# EAGLE design arduino_ver2 (EAGLE 9.6.2)
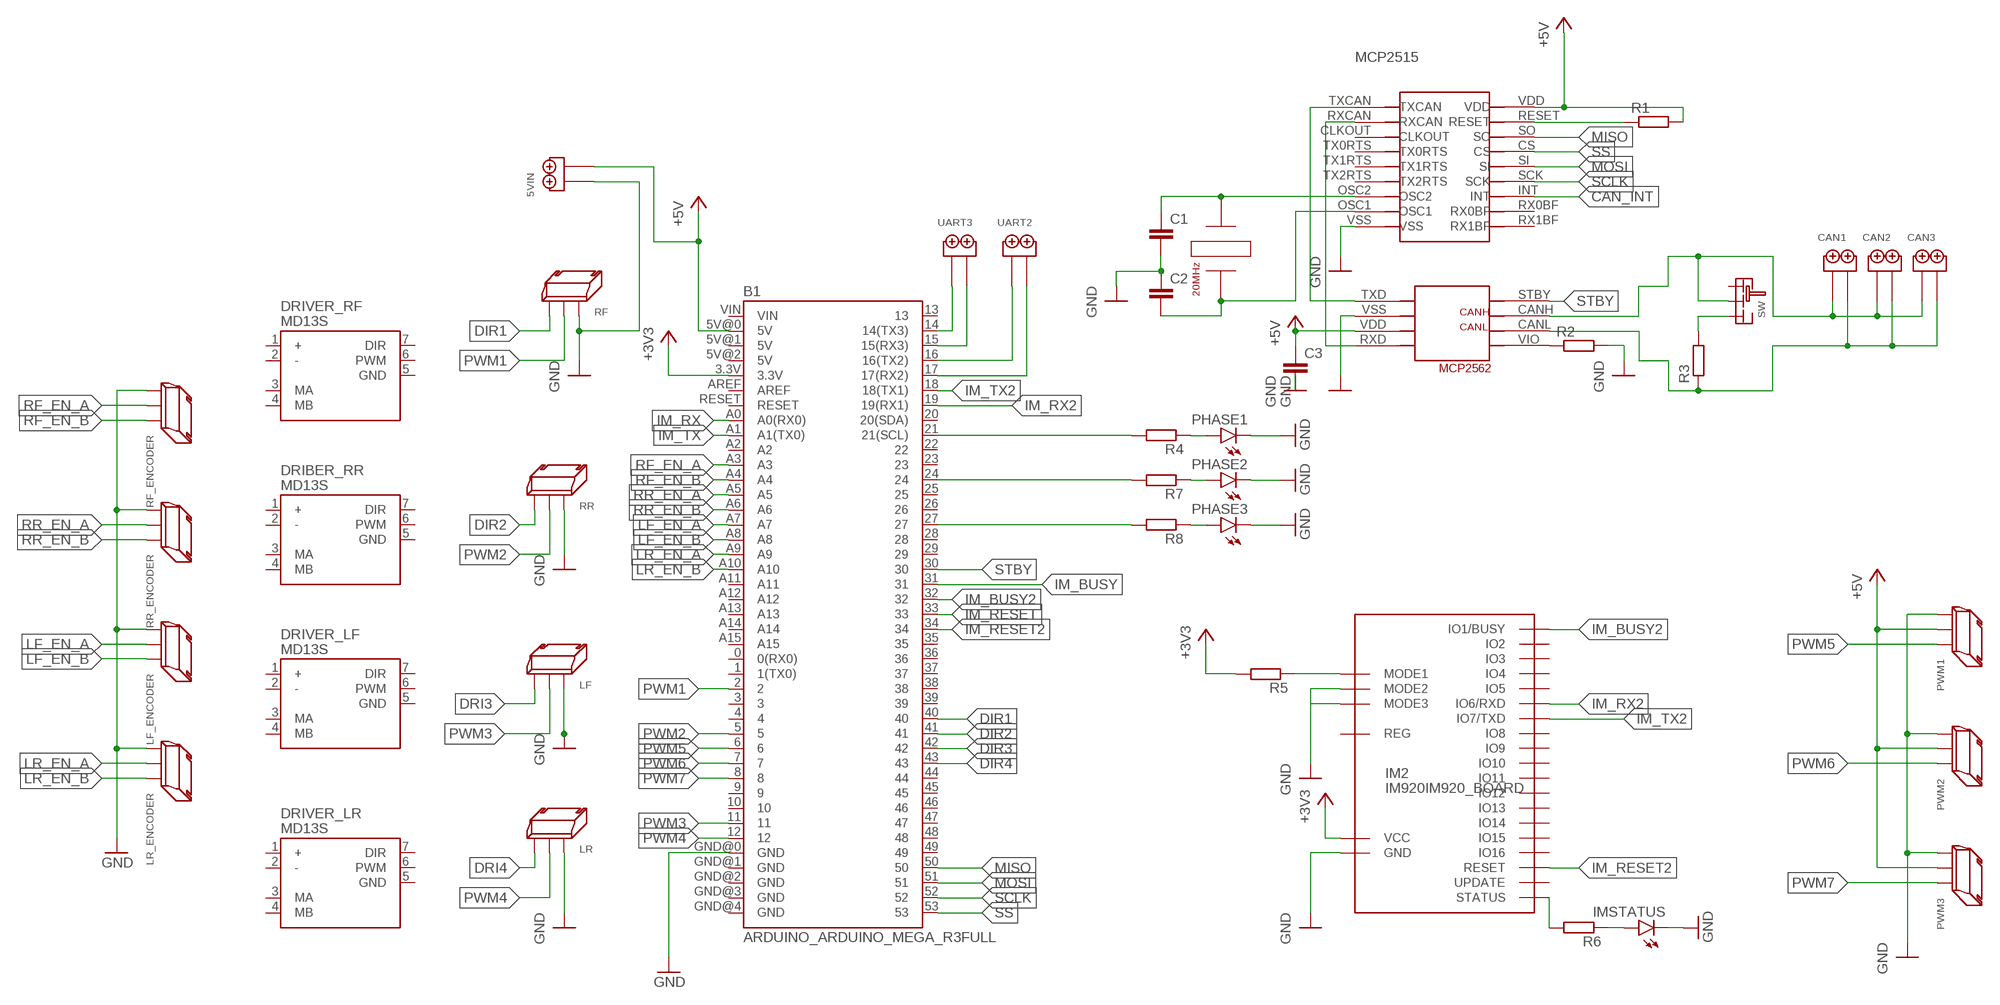
[diagram p0: schematic, sheet 1]

## Parts
5VIN  2PIN  [2PIN]
B1  ARDUINO_ARDUINO_MEGA_R3FULL  [ARDUINO_ARDUINO_MEGA]
C1  C-EU025-024X044  [C025-024X044]
C2  C-EU025-024X044  [C025-024X044]
C3  C-EU025-024X044  [C025-024X044]
CAN1  2PIN  [2PIN]
CAN2  2PIN  [2PIN]
CAN3  2PIN  [2PIN]
DRIBER_RR  MD13S  [MD13S]
DRIVER_LF  MD13S  [MD13S]
DRIVER_LR  MD13S  [MD13S]
DRIVER_RF  MD13S  [MD13S]
IM2  IM920IM920_BOARD  [IM920_BOARD]
IMSTATUS  LED3MM  [LED3MM]
LF  3PIN_SIDE  [3PIN_SIDE]
LF_ENCODER  3PIN_SIDE  [3PIN_SIDE]
LR  3PIN_SIDE  [3PIN_SIDE]
LR_ENCODER  3PIN_SIDE  [3PIN_SIDE]
MCP2  MCP2515  [MCP2515]
PHASE1  LED3MM  [LED3MM]
PHASE2  LED3MM  [LED3MM]
PHASE3  LED3MM  [LED3MM]
PWM1  3PIN_SIDE  [3PIN_SIDE]
PWM2  3PIN_SIDE  [3PIN_SIDE]
PWM3  3PIN_SIDE  [3PIN_SIDE]
R1  R-EU_0207/10  [0207/10]
R2  R-EU_0207/10  [0207/10]
R3  R-EU_0207/10  [0207/10]
R4  R-EU_0207/10  [0207/10]
R5  R-EU_0207/10  [0207/10]
R6  R-EU_0207/10  [0207/10]
R7  R-EU_0207/10  [0207/10]
R8  R-EU_0207/10  [0207/10]
RF  3PIN_SIDE  [3PIN_SIDE]
RF_ENCODER  3PIN_SIDE  [3PIN_SIDE]
RR  3PIN_SIDE  [3PIN_SIDE]
RR_ENCODER  3PIN_SIDE  [3PIN_SIDE]
SW  SRIDE_SWITCH  [SRIDE_SWITCH]
U$1  MCP2562  [MCP2562]
U$3  HUSG20  [HUSG20]
UART2  2PIN  [2PIN]
UART3  2PIN  [2PIN]

## Nets
+3V3: B1.3.3V R5.2
+5V [power]: 5VIN.P$2 B1.5V@0(5V) C3.1 MCP2.VDD R1.2 U$1.VDD
CAN_INT: MCP2.INT
DIR1: B1.40 RF.P$2
DIR2: B1.41 RR.P$2
DIR3: B1.42
DIR4: B1.43
DRI3: LF.P$2
DRI4: LR.P$2
GND: B1.GND@0(GND) IMSTATUS.K(C) LF_ENCODER.P$2 LR_ENCODER.P$2 PHASE1.K(C) PHASE2.K(C) PHASE3.K(C) R2.2 RF_ENCODER.P$2 RR_ENCODER.P$2
IM_BUSY: B1.31
IM_BUSY2 [im]: B1.32 IM2.IO1(IO1/BUSY)
IM_RESET: B1.33
IM_RESET2: B1.34 IM2.IO25(RESET)
IM_RX: B1.A0(A0(RX0))
IM_RX2 [im]: B1.19(19(RX1)) IM2.IO6(IO6/RXD)
IM_TX: B1.A1(A1(TX0))
IM_TX2 [im]: B1.18(18(TX1)) IM2.IO7(IO7/TXD)
LF_EN_A: B1.A7 LF_ENCODER.P$1
LF_EN_B: B1.A8 LF_ENCODER.P$3
LR_EN_A: B1.A9 LR_ENCODER.P$1
LR_EN_B: B1.A10 LR_ENCODER.P$3
MISO: B1.50 MCP2.SO
MOSI: B1.51 MCP2.SI
N$1: C1.1 MCP2.OSC2 U$3.A
N$2: C2.2 MCP2.OSC1 U$3.B
N$3: MCP2.TXCAN U$1.TXD
N$4: MCP2.RXCAN U$1.RXD
N$5: MCP2.RESET R1.1
N$6: R2.1 U$1.VIO
N$7: CAN1.P$1 CAN2.P$1 CAN3.P$1 SW.LR U$1.CANH
N$8: R3.2 SW.R
N$9: B1.21(21(SCL)) R4.2
N$10: IM2.IO19(MODE3)
N$11: CAN1.P$2 CAN2.P$2 CAN3.P$2 R3.1 U$1.CANL
N$12: PHASE1.A R4.1
N$13: PWM1.P$2 PWM2.P$2 PWM3.P$2
N$14 [im]: IM2.IO21(STATUS) R6.2
N$15: IMSTATUS.A R6.1
N$16: PWM1.P$1 PWM2.P$1 PWM3.P$1
N$17: B1.24 R7.2
N$18: PHASE2.A R7.1
N$19: B1.27 R8.2
N$20: PHASE3.A R8.1
N$21: B1.14(14(TX3)) UART3.P$1
N$22: B1.15(15(RX3)) UART3.P$2
N$23: B1.16(16(TX2)) UART2.P$1
N$24: B1.17(17(RX2)) UART2.P$2
N$25 [im]: IM2.IO17(MODE1) R5.1
N$26 [power]: IM2.IO23(VCC)
PWM1: B1.2 RF.P$1
PWM2: B1.5 RR.P$1
PWM3: B1.11 LF.P$1
PWM4: B1.12 LR.P$1
PWM5: B1.6 PWM1.P$3
PWM6: B1.7 PWM2.P$3
PWM7: B1.8 PWM3.P$3
RF_EN_A: B1.A3 RF_ENCODER.P$1
RF_EN_B: B1.A4 RF_ENCODER.P$3
RR_EN_A: B1.A5 RR_ENCODER.P$1
RR_EN_B: B1.A6 RR_ENCODER.P$3
SCLK: B1.52 MCP2.SCK
SS: B1.53 MCP2.CS
STBY: B1.30 U$1.STBY
V-: 5VIN.P$1 C1.2 C2.1 C3.2 IM2.IO18(MODE2) IM2.IO24(GND) LF.P$3 LR.P$3 MCP2.VSS RF.P$3 RR.P$3 U$1.VSS ; supply symbol labelled GND
Unconnected: B1.0(0(RX0)) B1.1(1(TX0)) B1.3 B1.4 B1.5V@1(5V) B1.5V@2(5V) B1.9 B1.10 B1.13 B1.20(20(SDA)) B1.22 B1.23 B1.25 B1.26 B1.28 B1.29 B1.35 B1.36 B1.37 B1.38 B1.39 B1.44 B1.45 B1.46 B1.47 B1.48 B1.49 B1.A2 B1.A11 B1.A12 B1.A13 B1.A14 B1.A15 B1.AREF B1.GND@1(GND) B1.GND@2(GND) B1.GND@3(GND) B1.GND@4(GND) B1.RESET B1.VIN DRIBER_RR.1(+) DRIBER_RR.2(-) DRIBER_RR.3(MA) DRIBER_RR.4(MB) DRIBER_RR.5(GND) DRIBER_RR.6(PWM) DRIBER_RR.7(DIR) DRIVER_LF.1(+) DRIVER_LF.2(-) DRIVER_LF.3(MA) DRIVER_LF.4(MB) DRIVER_LF.5(GND) DRIVER_LF.6(PWM) DRIVER_LF.7(DIR) DRIVER_LR.1(+) DRIVER_LR.2(-) DRIVER_LR.3(MA) DRIVER_LR.4(MB) DRIVER_LR.5(GND) DRIVER_LR.6(PWM) DRIVER_LR.7(DIR) DRIVER_RF.1(+) DRIVER_RF.2(-) DRIVER_RF.3(MA) DRIVER_RF.4(MB) DRIVER_RF.5(GND) DRIVER_RF.6(PWM) DRIVER_RF.7(DIR) IM2.IO2 IM2.IO3 IM2.IO4 IM2.IO5 IM2.IO8 IM2.IO9 IM2.IO10 IM2.IO11 IM2.IO12 IM2.IO13 IM2.IO14 IM2.IO15 IM2.IO16 IM2.IO20(UPDATE) IM2.IO22(REG) MCP2.CLKOUT MCP2.RX0BF MCP2.RX1BF MCP2.TX0RTS MCP2.TX1RTS MCP2.TX2RTS SW.L

## Library data of the parts
5VIN CAN1-CAN3 UART2 UART3 = TB113-2B-x-x-0-x-x:2PIN
B1 = ArduinoMega:ARDUINO_ARDUINO_MEGA_R3: Arduino Mega R3 ATmega2560 R3 compatible footprint. SparkFun Products: Arduino Mega 2560 R3 <https://www.sparkfun.com/products/11061>
C1-C3 = rcl:C-EU: CAPACITOR, European symbol; SPICEPREFIX: C
DRIBER_RR DRIVER_LF DRIVER_LR DRIVER_RF = Module:MD13S: 13Amp DC Motor Driver (MD13S) Created by: Wai Weng; CYTRON-PC: MD13S; DESC: 13Amp DC Motor Driver - GROVE Compatible; MF: Cytron; MPN: MD13S
IM2 = IM920:IM920
IMSTATUS PHASE1-PHASE3 = led:LED: LED OSRAM: - CHIPLED LG R971, LG N971, LY N971, LG Q971, LY Q971, LO R971, LY R971 LH N974, LH R974 LS Q976, LO Q976, LY Q976 LO Q996 - Hyper CHIPLED LW Q18S LB Q993, LB Q99A, LB R99A - SideLED LS A670, LO A670, LY A670, LG A670, LP A670 LB A673, LV A673, LT A673, LW A673 LH A674 LY A675 LS A676, LA A676, LO A676, LY A676, LW A676 LS A679, LY A679, LG A679 - Hyper Micro SIDELED® LS Y876, LA Y876, LO Y876, LY Y876 LT Y87S - SmartLED LW L88C, LW L88S LB L89C, LB L89S, LG L890 LS L89K, LO L89K, LY L89K LS L896, LA L896, LO L896, LY L896 - TOPLED LS T670, LO T670, LY T670, LG T670, LP T670 LSG T670, LSP T670, LSY T670, LOP T670, LYG T670 LG T671, LOG T671, LSG T671 LB T673, LV T673, LT T673, LW T673 LH T674 LS T676, LA T676, LO T676, LY T676, LB T676, LH T676, LSB T676, LW T676 LB T67C, LV T67C, LT T67C, LS T67K, LO T67K, LY T67K, LW E67C LS E67B, LA E67B, LO E67B, LY E67B, LB E67C, LV E67C, LT E67C LW T67C LS T679, LY T679, LG T679 LS T770, LO T770, LY T770, LG T770, LP T770 LB T773, LV T773, LT T773, LW T773 LH T774 LS E675, LA E675, LY E675, LS T675 LS T776, LA T776, LO T776, LY T776, LB T776 LHGB T686 LT T68C, LB T68C - Hyper Mini TOPLED® LB M676 - Mini TOPLED Santana® LG M470 LS M47K, LO M47K, LY M47K Source: http://www.osram.convergy.de LUXEON: - LUMILED® LXK2-PW12-R00, LXK2-PW12-S00, LXK2-PW14-U00, LXK2-PW14-V00 LXK2-PM12-R00, LXK2-PM12-S00, LXK2-PM14-U00 LXK2-PE12-Q00, LXK2-PE12-R00, LXK2-PE12-S00, LXK2-PE14-T00, LXK2-PE14-U00 LXK2-PB12-K00, LXK2-PB12-L00, LXK2-PB12-M00, LXK2-PB14-N00, LXK2-PB14-P00, LXK2-PB14-Q00 LXK2-PR12-L00, LXK2-PR12-M00, LXK2-PR14-Q00, LXK2-PR14-R00 LXK2-PD12-Q00, LXK2-PD12-R00, LXK2-PD12-S00 LXK2-PH12-R00, LXK2-PH12-S00 LXK2-PL12-P00, LXK2-PL12-Q00, LXK2-PL12-R00 Source: www.luxeon.com KINGBRIGHT: KA-3528ASYC Source: www.kingbright.com
LF LF_ENCODER LR LR_ENCODER PWM1-PWM3 RF RF_ENCODER RR RR_ENCODER = XR Connector:3PIN_SIDE
MCP2 = MCP2515:MCP2515
R1-R8 = rcl:R-EU_: RESISTOR, European symbol; SPICEPREFIX: R
SW = Sride Switch:SRIDE_SWITCH
U$1 = MCP2562:MCP2562
U$3 = HUSG20:HUSG20

## Net classes
0 default: width 0.381 mm
1 power: width 1.27 mm, clearance 0.508 mm
2 im: width 0.203 mm

## Board
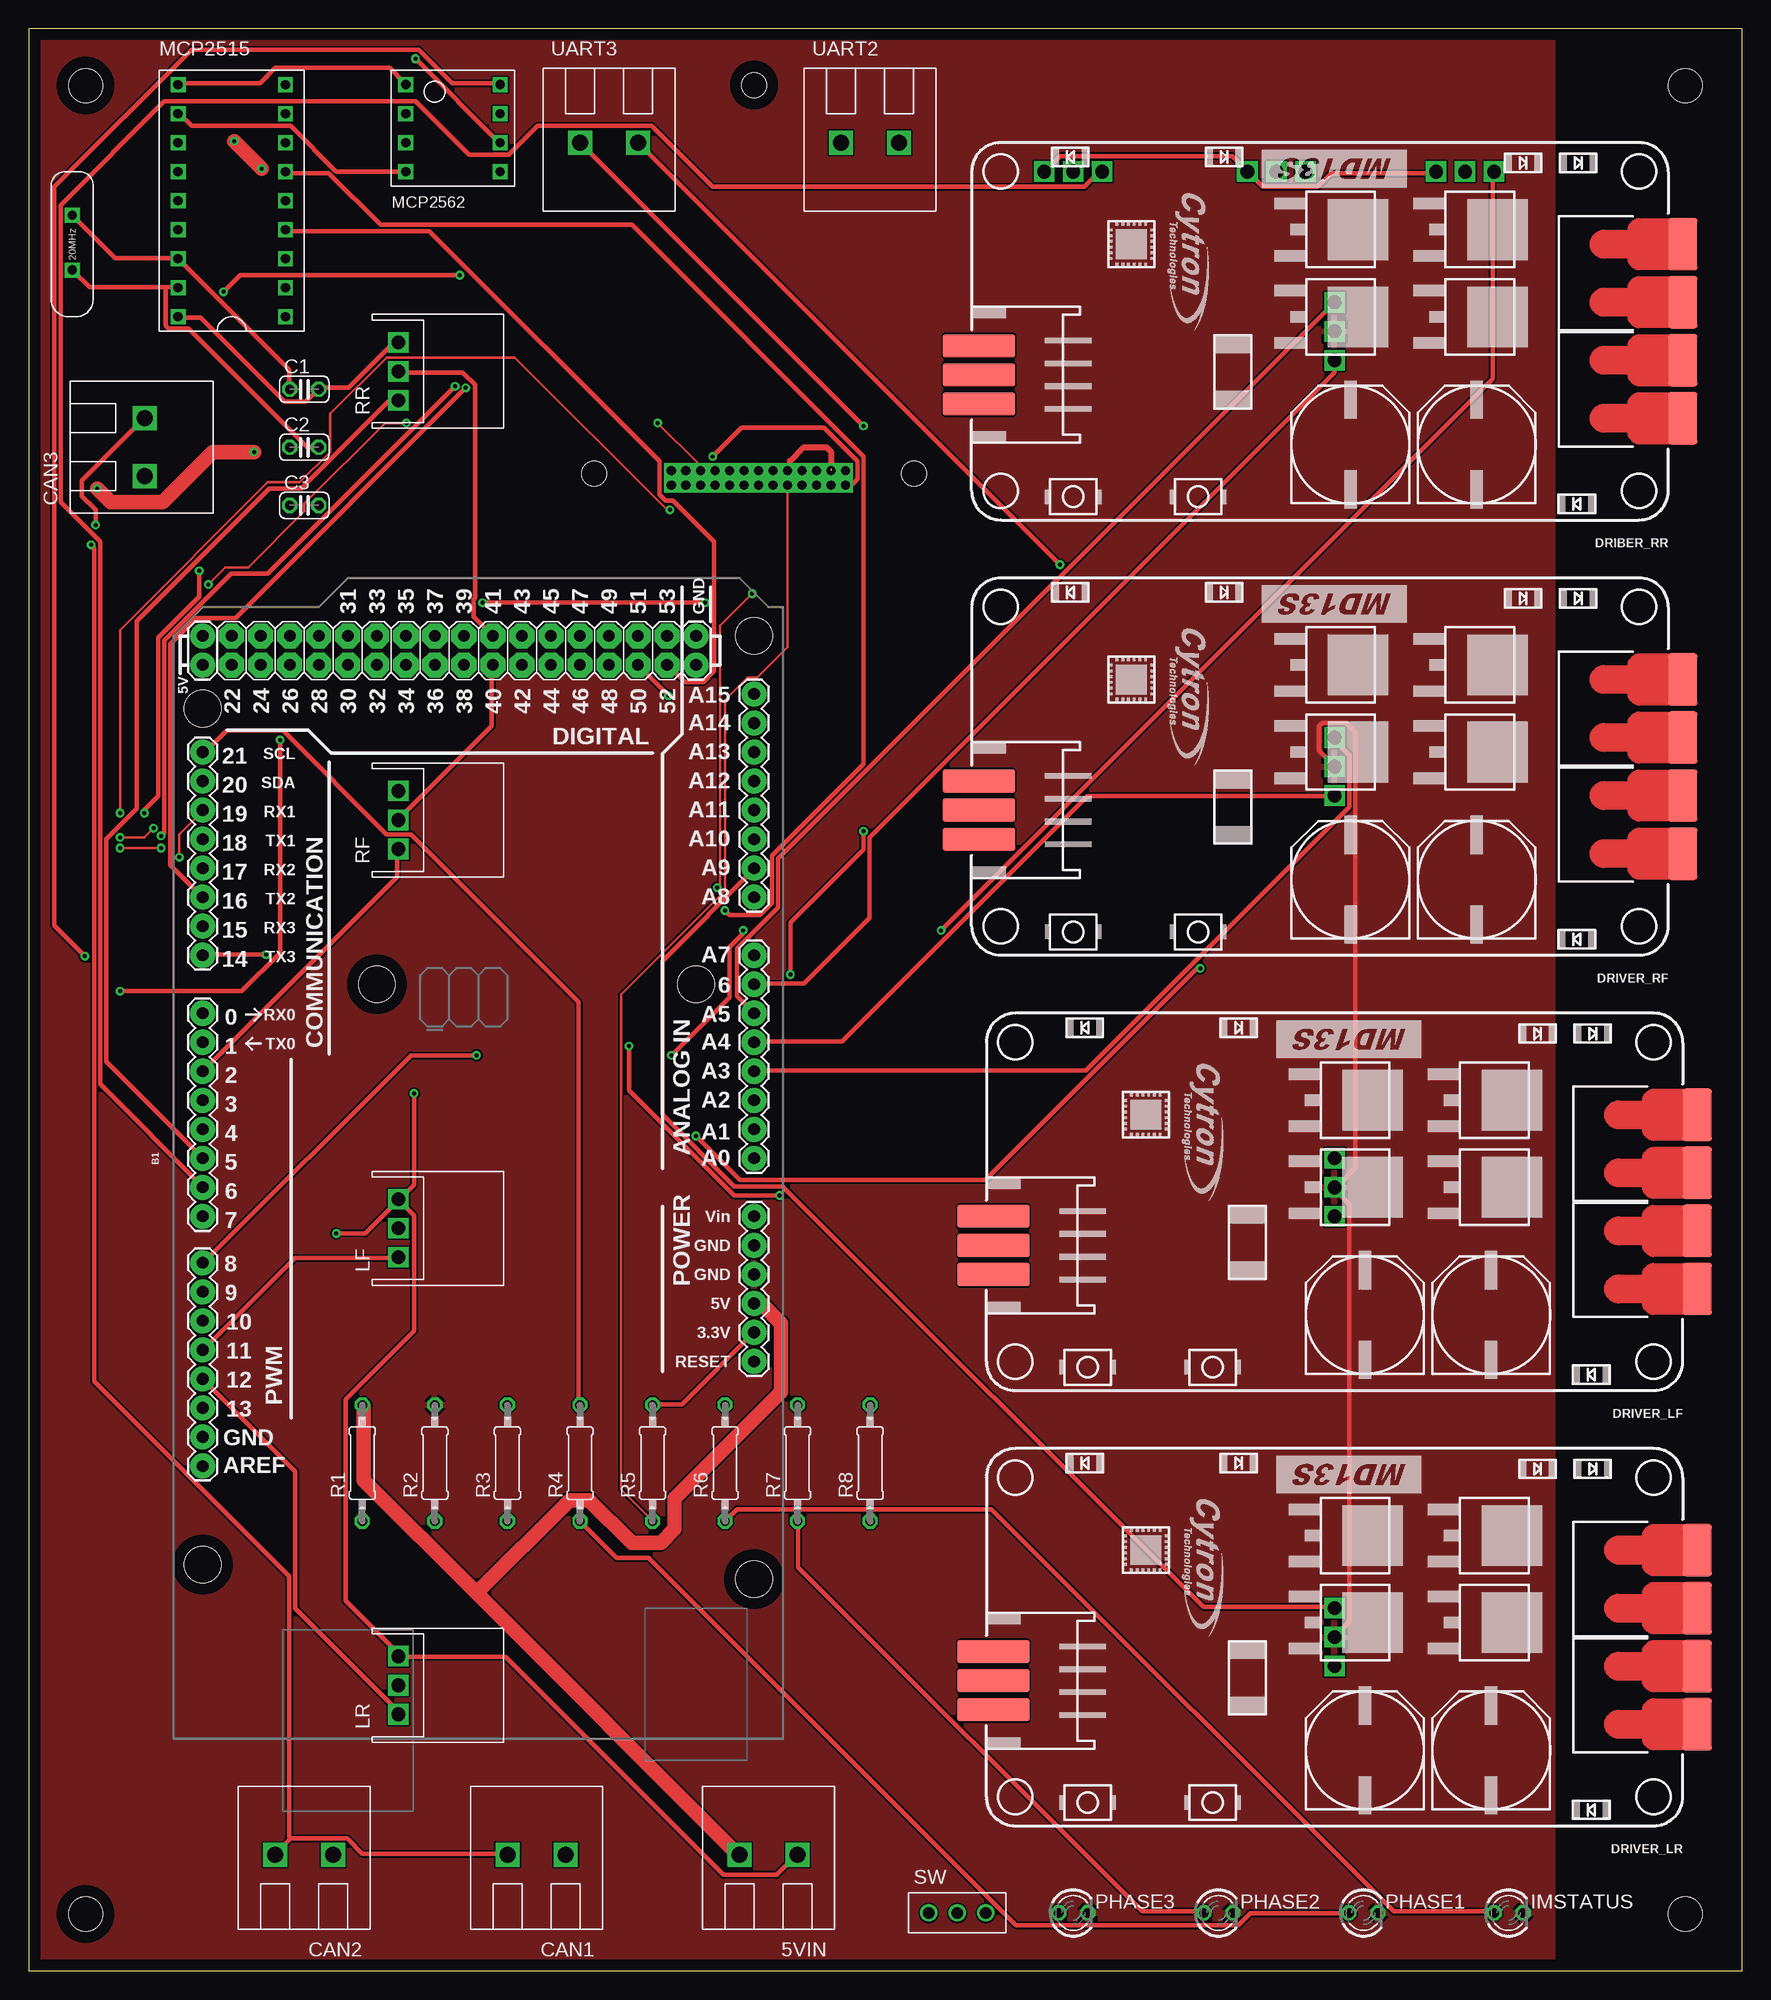
[diagram p1: board, top side]
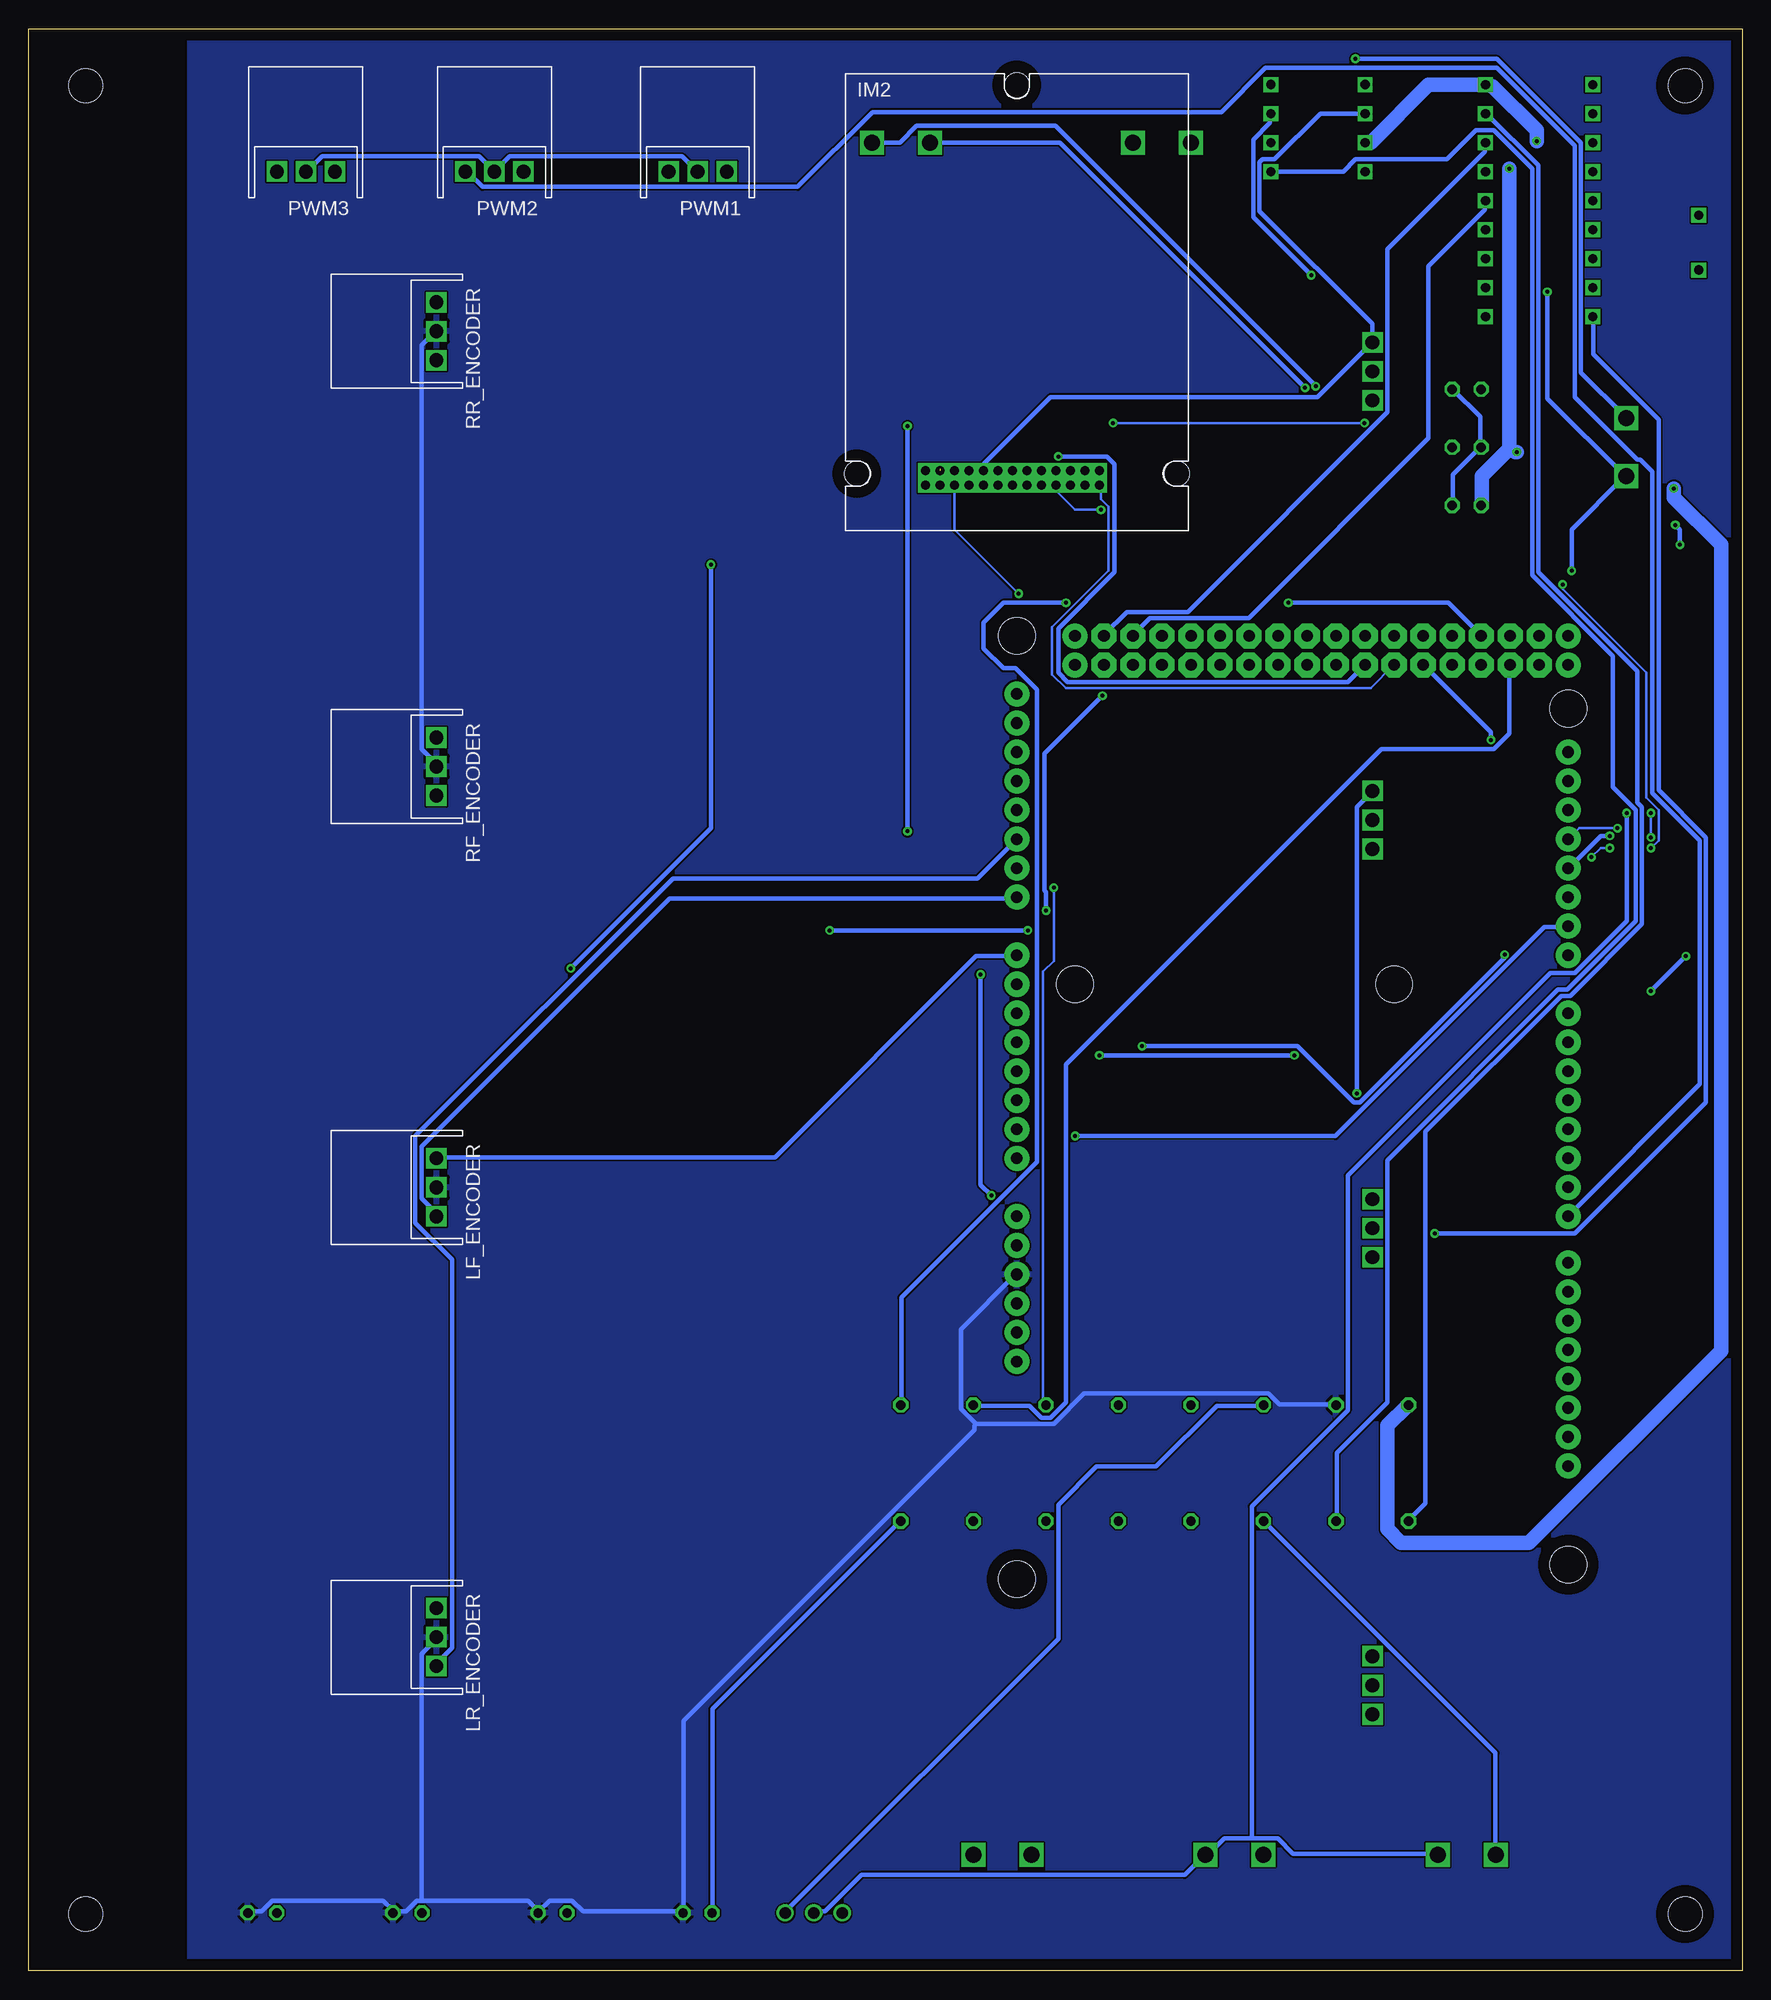
[diagram p2: board, bottom side, seen from below]

Size 150 x 170 mm. Coordinates in mm from the lower left corner, seen from the top.
Outline: 0,0 150,0 150,170 0,170 0,0
Copper layers (1*16): Top 0.035mm / dielectric 1.5mm / Bottom 0.035mm
Design rules "default": minimum track width 6mil, minimum drill 0.35mm, track to track 6mil, track to pad 6mil, pad to pad 6mil, via to via 6mil, smd to smd 6mil, copper to edge 40mil, drill to drill 6mil, minimum pad ring 10mil, minimum via ring 8mil, stop-mask expansion 4mil, vias tented up to drill 0mil, thermal gap 10mil
Holes 3 mm at 5,165 145,165 145,5 5,5

### Footprints (pad centres in the part's own frame; a part is rotated, then mirrored left to right if it is on the bottom)
2PIN = drill 1.4 square: P$1 -2.54,0; P$2 2.54,0
ARDUINO_ARDUINO_MEGA = drill 1.016 pad 2.2: 0 13.97,24.13; 1 11.43,24.13; 2 8.89,24.13; 3 6.35,24.13; 3.3V -13.97,-24.13; 4 3.81,24.13; 5 1.27,24.13; 5V@0 -11.43,-24.13; 5V@1 44.45,24.13; 5V@2 46.99,24.13; 6 -1.27,24.13; 7 -3.81,24.13; 8 -7.874,24.13; 9 -10.414,24.13; 10 -12.954,24.13; 11 -15.494,24.13; 12 -18.034,24.13; 13 -20.574,24.13; 14 19.05,24.13; 15 21.59,24.13; 16 24.13,24.13; 17 26.67,24.13; 18 29.21,24.13; 19 31.75,24.13; 20 34.29,24.13; 21 36.83,24.13; A0 1.27,-24.13; A1 3.81,-24.13; A2 6.35,-24.13; A3 8.89,-24.13; A4 11.43,-24.13; A5 13.97,-24.13; A6 16.51,-24.13; A7 19.05,-24.13; A8 24.13,-24.13; A9 26.67,-24.13; A10 29.21,-24.13; A11 31.75,-24.13; A12 34.29,-24.13; A13 36.83,-24.13; A14 39.37,-24.13; A15 41.91,-24.13; AREF -25.654,24.13; GND@0 -8.89,-24.13; GND@1 -6.35,-24.13; GND@2 44.45,-19.05; GND@3 46.99,-19.05; GND@4 -23.114,24.13; RESET -16.51,-24.13; VIN -3.81,-24.13 | drill 1.016 pad 2.2 octagon: 22 44.45,21.59; 23 46.99,21.59; 24 44.45,19.05; 25 46.99,19.05; 26 44.45,16.51; 27 46.99,16.51; 28 44.45,13.97; 29 46.99,13.97; 30 44.45,11.43; 31 46.99,11.43; 32 44.45,8.89; 33 46.99,8.89; 34 44.45,6.35; 35 46.99,6.35; 36 44.45,3.81; 37 46.99,3.81; 38 44.45,1.27; 39 46.99,1.27; 40 44.45,-1.27; 41 46.99,-1.27; 42 44.45,-3.81; 43 46.99,-3.81; 44 44.45,-6.35; 45 46.99,-6.35; 46 44.45,-8.89; 47 46.99,-8.89; 48 44.45,-11.43; 49 46.99,-11.43; 50 44.45,-13.97; 51 46.99,-13.97; 52 44.45,-16.51; 53 46.99,-16.51 | hole 3.2: -34.29,24.13; -35.56,-24.13; 16.51,8.89; 16.51,-19.05; 40.64,24.13; 46.99,-24.13
C025-024X044 = drill 0.813 octagon: 1 -1.27,0; 2 1.27,0
MD13S = smd 2.54 x 4.572: 1 -1.27,24.13; 2 -1.27,19.05; 3 -1.27,13.97; 4 -1.27,8.89 | smd 6.35 x 2.032: 5 60.325,17.78; 6 60.325,20.32; 7 60.325,22.86
IM920_BOARD = drill 0.8 pad 0.813 square: IO1 7.24,-17.27; IO2 7.24,-16; IO3 5.97,-17.27; IO4 5.97,-16; IO5 4.7,-17.27; IO6 4.7,-16; IO7 3.43,-17.27; IO8 3.43,-16; IO9 2.16,-17.27; IO10 2.16,-16; IO11 0.89,-17.27; IO12 0.89,-16; IO13 -0.38,-17.27; IO14 -0.38,-16; IO15 -1.65,-17.27; IO16 -1.65,-16; IO17 -2.92,-17.27; IO18 -2.92,-16; IO19 -4.19,-17.27; IO20 -4.19,-16; IO21 -5.46,-17.27; IO22 -5.46,-16; IO23 -6.73,-17.27; IO24 -6.73,-16; IO25 -8,-17.27; IO26 -8,-16 | hole 2.2: -14,-16.27; 14,-16.27; 0,17.73
LED3MM = drill 0.813 octagon: A -1.27,0; K 1.27,0
3PIN_SIDE = drill 1.2 square: P$1 -2.54,0; P$2 0,0; P$3 2.54,0
MCP2515 = drill 0.8 square: CLKOUT -4.7,5.08; CS 4.7,5.08; INT 4.7,-5.08; OSC1 -4.7,-7.62; OSC2 -4.7,-5.08; RESET 4.7,7.62; RX0BF 4.7,-7.62; RX1BF 4.7,-10.16; RXCAN -4.7,7.62; SCK 4.7,-2.54; SI 4.7,0; SO 4.7,2.54; TX0RTS -4.7,2.54; TX1RTS -4.7,0; TX2RTS -4.7,-2.54; TXCAN -4.7,10.16; VDD 4.7,10.16; VSS -4.7,-10.16
0207/10 = drill 0.813 octagon: 1 -5.08,0; 2 5.08,0
SRIDE_SWITCH = drill 1: L -2.5,0; LR 0,0; R 2.5,0
MCP2562 = drill 0.8 square: CANH 8.255,6.35; CANL 8.255,3.81; RXD 0,1.27; STBY 8.255,8.89; TXD 0,8.89; VDD 0,3.81; VIO 8.255,1.27; VSS 0,6.35
HUSG20 = drill 0.8 square: A 1.27,0; B 6.07,0

### Placement (x,y rotation side)
5VIN  64.77,10.16 180 top
B1  39.37,69.85 90 top
C1  24.13,138.43 0 top
C2  24.13,133.35 0 top
C3  24.13,128.27 0 top
CAN1  44.45,10.16 180 top
CAN2  24.13,10.16 180 top
CAN3  10.16,133.35 90 top
DRIBER_RR  143.51,160.02 180 top
DRIVER_LF  144.78,83.82 180 top
DRIVER_LR  144.78,45.72 180 top
DRIVER_RF  143.51,121.92 180 top
IM2  63.5,147.32 0 bottom
IMSTATUS  129.54,5.08 0 top
LF  32.38,65 90 top
LF_ENCODER  114.3,68.58 270 bottom
LR  32.38,25 90 top
LR_ENCODER  114.3,29.21 270 bottom
MCP2  17.78,154.94 0 top
PHASE1  116.84,5.08 0 top
PHASE2  104.14,5.08 0 top
PHASE3  91.44,5.08 0 top
PWM1  91.44,157.48 180 bottom
PWM2  109.22,157.48 180 bottom
PWM3  125.73,157.48 180 bottom
R1  29.21,44.45 90 top
R2  35.56,44.45 90 top
R3  41.91,44.45 90 top
R4  48.26,44.45 90 top
R5  54.61,44.45 90 top
R6  60.96,44.45 90 top
R7  67.31,44.45 90 top
R8  73.66,44.45 90 top
RF  32.38,100.73 90 top
RF_ENCODER  114.3,105.41 270 bottom
RR  32.38,140 90 top
RR_ENCODER  114.3,143.51 270 bottom
SW  81.28,5.08 0 top
U$1  33.02,156.21 0 top
U$3  3.81,154.94 270 top
UART2  73.66,160.02 0 top
UART3  50.8,160.02 0 top

### Tracks (layer width: path | path; a pad name or v marks a point on that pad's centre or on a via)
+3V3
  Top 0.381: R5.2 54.67,49.61 57.21,49.61 63.48,55.87 B1.3.3V
+5V  (via drill 0.35)
  Top 1.27: v18,160.15 v20.4,157.75 | 39.2,33.07 62.14,10.13 5VIN.P$2 | 39.2,33.07 29.34,42.94 29.34,49.47 R1.2 | B1.5V@0 64.14,58.42 65.88,56.68 65.88,50.67 56.54,41.34 56.54,38.67 55.34,37.47 52.81,37.47 49.07,41.2 47.34,41.2 39.2,33.07 | v19.74,132.95 16.14,132.95 11.73,128.55 7.2,128.55 v6,129.75
  Bottom 1.27: U$1.VDD 32.54,160.02 27.47,165.09 22.54,165.09 MCP2.VDD 21.87,164.95 18,161.09 v18,160.15 | 20.4,133.22 22.8,130.82 22.8,128.28 C3.1 | v20.4,157.75 20.4,133.22 | v19.74,132.95 19.87,132.95 20.4,133.22 | v6,129.75 6,128.95 1.87,124.82 1.87,54.27 18.67,37.47 29.87,37.47 31.07,38.67 31.07,47.74 29.34,49.47 R1.2
DIR1
  Top 0.381: RF.P$2 32.4,100.81 40.54,108.95 40.54,114.28 B1.40
DIR2
  Top 0.381: RR.P$2 32.4,139.88 38.01,139.88 39.07,138.82 39.07,120.15 38.94,120.02 38.94,118.55 40.54,116.95 B1.41
GND
  Top 0.381: LR_ENCODER.P$2 114.41,29.34 115.61,30.54 115.61,67.08 114.41,68.28 114.41,68.54 LF_ENCODER.P$2 114.55,68.67 116.15,70.28 116.15,108.41 115.35,109.21 113.21,109.21 112.95,108.95 112.95,106.81 114.28,105.48 RF_ENCODER.P$2
  Bottom 0.381: 67.08,47.87 60.27,47.87 57.61,50.54 41.47,50.54 40.54,49.61 35.6,49.61 R2.2 | 67.08,47.87 68.41,49.21 68.41,56.14 63.61,60.94 B1.GND@0 | RF_ENCODER.P$2 114.41,105.48 114.41,105.75 115.61,106.95 115.61,142.28 114.41,143.49 RR_ENCODER.P$2 | 115.61,6.13 106.28,6.13 105.48,5.33 PHASE2.K 105.35,5.2 104.41,6.13 102.41,6.13 101.48,5.2 92.81,5.2 PHASE3.K 92.68,5.33 92.68,21.87 67.21,47.34 67.21,47.74 67.08,47.87 | 115.61,6.13 116.01,6.13 116.95,5.2 118.02,5.2 PHASE1.K 118.15,5.33 118.95,6.13 128.68,6.13 129.62,5.2 130.68,5.2 IMSTATUS.K | 115.61,6.13 115.61,27.74 114.41,28.94 114.41,29.2 LR_ENCODER.P$2
  pour Top: -5.08,172.72 133.35,172.72 133.35,-5.08 -6.35,-5.08 -6.35,172.72
  pour Bottom: 135.89,175.26 135.89,-6.35 134.62,-7.62 -8.89,-7.62 -11.43,179.07
IM_BUSY2
  Bottom 0.203: IM2.IO1 56.14,130.02 56.14,128.82 55.47,128.15 55.47,122.55 60.41,117.61 60.41,113.48 59.21,112.28 32.54,112.28 30.54,114.28 B1.32
IM_RESET2  (via drill 0.35)
  Top 0.381: v59.87,132.55 62.41,135.09 69.6,135.09 72.54,132.15 72.54,130.55 72.14,130.15 71.61,130.15 IM2.IO25
  Bottom 0.381: v59.87,132.55 55.61,132.55 54.94,131.88 54.94,122.42 59.87,117.48 59.87,113.61 59.07,112.81 34.54,112.81 33.07,114.28 B1.34
IM_RX2  (via drill 0.35)
  Top 0.203: v55.07,135.48 58.67,131.88 58.67,131.35 IM2.IO6 | v33.07,135.48 31.2,135.48 24.14,128.42 24.14,127.75 19.2,122.81 17.2,122.81 v15.73,121.35 | v11.6,98.28 v8,98.28 | v13.2,97.48 13.2,99.48 15.2,101.48 B1.19
  Bottom 0.203: v33.07,135.48 v55.07,135.48 | v15.73,121.35 15.73,120.95 8.4,113.61 8.4,102.68 7.33,101.61 7.33,98.95 v8,98.28 | v11.6,98.28 12.4,98.28 v13.2,97.48
IM_TX2  (via drill 0.35)
  Top 0.203: v56.14,127.88 55.87,127.88 42.54,141.22 31.34,141.22 26.4,136.28 26.4,132.95 23.74,130.28 20.94,130.28 8,117.35 v8,101.35 | v8,99.21 10.13,99.21 v10.94,100.01
  Bottom 0.203: v56.14,127.88 58.41,127.88 60.01,129.48 60.01,130.02 IM2.IO7 | v8,99.21 v8,101.35 | v10.94,100.01 14.27,100.01 15.2,99.08 B1.18
LF_EN_A
  Bottom 0.381: LF_ENCODER.P$1 114.28,71.21 84.68,71.21 67.08,88.81 63.61,88.81 B1.A7
LF_EN_B
  Bottom 0.381: LF_ENCODER.P$3 114.41,66.14 114.41,66.41 115.61,67.61 115.61,72.14 93.88,93.88 63.61,93.88 B1.A8
LR_EN_A
  Top 0.381: LR_ENCODER.P$1 114.28,31.87 102.81,31.87 66.01,68.67 61.74,68.67 55.47,74.94 55.47,88.41 63.48,96.41 B1.A9
LR_EN_B
  Bottom 0.381: LR_ENCODER.P$3 114.28,26.67 114.28,26.94 112.95,28.27 112.95,62.27 116.15,65.47 116.15,73.08 93.61,95.61 66.94,95.61 63.61,98.95 B1.A10
MISO  (via drill 0.35)
  Top 0.381: v60.94,92.81 61.34,92.41 64.01,92.41 65.08,93.48 65.08,97.61 73.08,105.61 73.08,132.55 52.81,152.82 30.8,152.82 26.27,157.35 22.54,157.35 MCP2.SO | v56.01,111.61 53.34,114.28 B1.50
  Bottom 0.381: v60.94,92.81 60.94,94.41 61.07,94.55 61.07,106.55 v56.01,111.61
MOSI
  Bottom 0.381: MCP2.SI 22.54,154.82 22.54,154.15 27.47,149.22 27.47,134.15 43.2,118.42 51.87,118.42 53.34,116.95 B1.51
N$1
  Top 0.381: U$3.A 3.87,153.62 7.6,149.88 13.07,149.88 MCP2.OSC2 13.2,149.75 22.8,140.15 22.8,138.55 C1.1
N$2
  Top 0.381: 12,147.35 5.33,147.35 3.87,148.82 U$3.B | 12,147.35 13.07,147.35 MCP2.OSC1 | C2.2 24.4,133.35 14,143.75 12.27,143.75 12,144.02 12,147.35
N$3
  Top 0.381: MCP2.TXCAN 13.2,165.22 20.27,165.22 21.6,166.55 31.6,166.55 32.94,165.22 U$1.TXD
N$4
  Top 0.381: U$1.RXD 32.94,157.49 26.94,157.49 22.94,161.49 14.27,161.49 13.2,162.55 MCP2.RXCAN
N$5
  Bottom 0.381: MCP2.RESET 22.4,162.55 17.87,158.02 17.87,122.42 9.2,113.75 9.2,102.28 8.8,101.88 8.8,91.61 15.07,85.34 15.87,85.34 27.74,73.48 27.74,40.94 29.2,39.47 R1.1
N$6
  Bottom 0.381: U$1.VIO 41.2,157.49 34.94,157.49 33.87,158.55 25.87,158.55 23.34,161.09 21.74,161.09 18.4,157.75 18.4,122.15 11.34,115.08 11.34,103.61 9.34,101.61 9.34,91.88 15.34,85.88 16.14,85.88 31.07,70.94 31.07,49.74 35.47,45.34 35.47,39.47 R2.1
N$7  (via drill 0.35)
  Top 0.381: v37.74,148.42 18.54,148.42 v17.07,146.95 | v10.13,101.35 10.13,101.61 11.34,102.81 11.34,116.68 14.94,120.28 v14.94,122.55
  Bottom 0.381: SW.LR 81.21,5.2 80.28,5.2 77.08,8.4 48.81,8.4 47.07,10.13 CAN1.P$1 46.81,10.13 45.34,11.6 42.94,11.6 | 42.94,11.6 40.67,11.6 39.34,10.27 26.67,10.27 CAN2.P$1 | v37.74,148.42 42.8,153.49 42.8,160.29 41.34,161.75 41.34,162.55 U$1.CANH | v17.07,146.95 17.07,137.62 10.27,130.82 CAN3.P$1 10.4,130.68 14.94,126.15 v14.94,122.55 | 42.94,11.6 42.94,40.67 34.54,49.07 34.54,69.61 16.8,87.34 14.67,87.34 10.13,91.88 v10.13,101.35
N$8
  Bottom 0.381: R3.2 42.01,49.47 46.01,49.47 51.34,44.14 56.54,44.14 59.87,40.8 59.87,29.07 83.74,5.2 SW.R
N$9
  Top 0.381: B1.21 15.47,106.68 17.34,108.55 22.27,108.55 31.34,99.48 33.47,99.48 48.14,84.81 48.14,49.61 R4.2
N$11  (via drill 0.35)
  Top 0.381: 22.94,11.6 27.87,11.6 29.2,10.27 41.87,10.27 CAN1.P$2 | 22.94,11.6 21.6,10.27 CAN2.P$2 | v33.87,167.35 41.2,160.02 U$1.CANL | v5.47,124.82 5.73,124.55 5.73,51.61 22.8,34.54 22.8,11.73 22.94,11.6 | v5.87,126.55 5.87,127.88 4.67,129.08 4.67,130.42 10.13,135.88 CAN3.P$2
  Bottom 0.381: R3.1 41.87,39.34 21.6,19.07 21.6,10.27 CAN2.P$2 | v33.87,167.35 21.47,167.35 14.13,160.02 14.13,139.88 10.27,136.02 CAN3.P$2 | v5.47,124.82 5.47,126.15 v5.87,126.55
N$12
  Top 0.381: PHASE1.A 115.48,5.07 106.95,5.07 105.88,4 86.41,4 54.27,36.14 51.47,36.14 48.27,39.34 R4.1
N$13
  Bottom 0.381: PWM1.P$2 91.48,157.49 92.81,158.82 107.88,158.82 PWM2.P$2 109.35,157.62 110.55,158.82 124.28,158.82 125.62,157.49 PWM3.P$2
N$14  (via drill 0.35)
  Top 0.203: v63.34,120.55 60.54,117.75 60.54,95.08 v60.27,94.81
  Bottom 0.203: v63.34,120.55 68.94,126.15 68.94,130.02 IM2.IO21 | v60.27,94.81 60.27,88.41 61.21,87.48 61.21,49.74 61.07,49.61 R6.2
N$15
  Top 0.381: IMSTATUS.A 128.15,5.2 119.48,5.2 84.28,40.41 62.01,40.41 61.07,39.47 R6.1
N$16
  Top 0.381: PWM1.P$1 88.94,157.49 90.28,158.82 105.35,158.82 PWM2.P$1 106.81,157.35 108.01,156.15 112.81,156.15 114.01,157.35 123.08,157.35 PWM3.P$1
N$17
  Bottom 0.381: R7.2 67.21,49.47 62.41,49.47 61.34,48.41 60.54,48.41 59.21,49.74 59.21,79.34 31.6,106.95 21.74,106.95 20.4,108.28 20.4,114.28 B1.24
N$18
  Top 0.381: PHASE2.A 102.81,5.2 97.48,5.2 67.34,35.34 67.34,39.34 R7.1
N$19  (via drill 0.35)
  Top 0.381: v39.74,119.75 v59.21,119.75
  Bottom 0.381: v59.21,119.75 64.67,119.75 66.41,118.02 66.41,115.75 64.67,114.01 63.61,114.01 61.74,112.15 61.74,70.81 73.61,58.94 73.61,49.61 R8.2 | v39.74,119.75 25.74,119.75 22.94,116.95 B1.27
N$20
  Bottom 0.381: R8.1 73.74,39.34 90.14,22.94 90.14,5.2 PHASE3.A
N$21  (via drill 0.35)
  Top 0.381: v73.08,135.22 48.27,160.02 UART3.P$1 | v73.08,99.75 73.08,98.15 66.67,91.75 v66.67,87.21 | v65.74,67.88 61.74,67.88 52.54,77.08 v52.54,80.94 | v20.8,88.94 15.34,88.94 B1.14
  Bottom 0.381: v73.08,99.75 v73.08,135.22 | v66.67,87.21 66.67,68.81 v65.74,67.88 | v52.54,80.94 38.94,80.94 34,76.01 33.47,76.01 20.8,88.68 v20.8,88.94
N$22  (via drill 0.35)
  Top 0.381: v90.28,123.08 UART3.P$2 | v102.55,87.74 102.28,87.74 83.74,69.21 62.27,69.21 v58.41,73.08
  Bottom 0.381: v90.28,123.08 90.28,100.01 v102.55,87.74 | v58.41,73.08 35.6,73.08 17.34,91.34 15.34,91.34 B1.15
N$23  (via drill 0.35)
  Top 0.381: v38.27,138.55 18.14,118.42 14.67,118.42 12.4,116.15 12.4,96.81 15.2,94.01 B1.16
  Bottom 0.381: UART2.P$1 59.74,160.02 v38.27,138.55
N$24  (via drill 0.35)
  Top 0.381: v37.34,138.68 20.94,122.28 17.74,122.28 11.87,116.42 11.87,99.61 v11.6,99.35
  Bottom 0.381: UART2.P$2 73.74,160.02 72.28,161.49 60.14,161.49 v37.34,138.68 | v11.6,99.35 12.4,99.35 15.2,96.55 B1.17
N$25
  Top 0.203: IM2.IO17 66.41,130.02 66.41,115.88 63.74,113.21 62.94,113.21 60.94,111.21 60.94,94.55 51.87,85.48 51.87,42.14 54.54,39.47 R5.1
PWM1
  Top 0.381: RF.P$1 32.27,98.15 32.27,95.75 15.34,78.81 B1.2
PWM2
  Top 0.381: RR.P$1 32.27,137.35 31.47,137.35 23.87,129.75 21.07,129.75 9.47,118.15 9.47,101.75 6.8,99.08 6.8,79.61 15.2,71.21 B1.5
PWM3
  Top 0.381: LF.P$1 32.27,62.41 23.34,62.41 15.34,54.41 B1.11
PWM4
  Top 0.381: LR.P$1 32.27,22.54 32.27,22.8 23.34,31.74 23.34,43.74 15.34,51.74 B1.12
PWM5
  Top 0.381: PWM1.P$3 93.88,157.35 93.61,157.35 92.41,156.15 59.87,156.15 54.54,161.49 44.54,161.49 42.01,158.95 38.54,158.95 33.87,163.62 11.87,163.62 2.8,154.55 2.8,128.55 6.27,125.08 6.27,77.61 15.2,68.67 B1.6
PWM6
  Bottom 0.381: PWM2.P$3 111.75,157.35 111.48,157.35 110.28,156.15 82.68,156.15 76.14,162.69 45.61,162.69 41.74,166.55 21.47,166.55 14.67,159.75 14.67,137.75 9.2,132.28 8.93,132.28 7.87,131.22 7.87,103.08 3.73,98.95 3.73,77.61 15.2,66.14 B1.7
PWM7  (via drill 0.35)
  Top 0.381: v79.88,91.08 128.15,139.35 128.15,157.35 PWM3.P$3 | v62.54,91.08 62.54,90.81 61.34,89.61 61.34,85.21 v56.27,80.14 | v39.2,80.14 33.47,80.14 15.34,62.01 B1.8
  Bottom 0.381: v62.54,91.08 v79.88,91.08 | v39.2,80.14 v56.27,80.14
RF_EN_A
  Top 0.381: RF_ENCODER.P$1 114.41,107.88 114.41,107.61 115.61,106.41 115.61,101.88 92.55,78.81 63.61,78.81 B1.A3
RF_EN_B
  Top 0.381: RF_ENCODER.P$3 114.28,102.81 92.68,102.81 71.21,81.34 63.61,81.34 B1.A4
RR_EN_A
  Top 0.381: RR_ENCODER.P$1 114.28,146.02 65.61,97.35 65.61,93.08 62.01,89.48 62.01,85.34 63.48,83.88 B1.A5
RR_EN_B
  Top 0.381: RR_ENCODER.P$3 114.28,140.95 114.28,139.88 73.61,99.21 73.61,92.14 67.88,86.41 63.61,86.41 B1.A6
SCLK
  Top 0.381: MCP2.SCK 22.54,152.29 35.07,152.29 55.21,132.15 55.21,129.22 55.74,128.68 56.41,128.68 60.01,125.08 60.01,113.75 59.07,112.81 57.47,112.81 56.01,114.28 B1.52
SS
  Bottom 0.381: MCP2.CS 22.54,160.02 22.54,159.22 31.07,150.69 31.07,136.42 48.54,118.95 53.87,118.95 55.87,116.95 B1.53
STBY  (via drill 0.35)
  Top 0.381: v4.93,88.81 2.27,91.48 2.27,156.15 14.27,168.15 34.14,168.15 37.07,165.22 41.2,165.22 U$1.STBY | v8,85.74 18.67,85.74 22,89.08 v22,107.75
  Bottom 0.381: v8,85.74 v4.93,88.81 | v22,107.75 22,108.41 27.87,114.28 B1.30
V-  (via drill 0.35)  (1 unrouted)
  Top 0.381: MCP2.VSS 13.2,144.69 15.07,144.69 22.4,137.35 24.27,137.35 25.34,138.42 C1.2 25.47,138.55 28,138.55 31.87,142.42 32.27,142.42 RR.P$3 | 5VIN.P$1 67.21,10.13 65.47,8.4 60.81,8.4 41.74,27.47 32.4,27.47 LR.P$3 32.4,27.74 27.74,32.4 27.74,50.01 33.74,56.01 33.74,66.14 32.4,67.47 LF.P$3 | v33.74,76.81 33.74,68.81 32.54,67.61 LF.P$3 | v26.94,64.54 29.47,64.54 32.27,67.34 LF.P$3
  Top 0.508: IM2.IO18 66.63,131.53 66.63,132.14 67.84,133.35 68.58,133.35 69.85,133.35 70.23,132.97 70.23,131.47
  Bottom 0.381: C1.2 25.34,138.42 22.94,136.02 22.94,133.35 C2.1 23.07,133.22 25.34,130.95 25.34,128.28 C3.2 | U$1.VSS 33.07,162.55 36.94,162.55 40.94,158.55 42.01,158.55 42.27,158.29 42.27,154.02 32.4,144.15 32.4,142.55 RR.P$3 32.54,142.42 37.2,137.75 60.54,137.75 66.41,131.88 66.41,131.35 IM2.IO18 | v33.74,76.81 33.74,101.88 32.4,103.21 RF.P$3 | v26.94,64.54 14.67,64.54 3.2,76.01 3.2,99.21 7.33,103.35 7.33,135.75 13.07,141.48 13.07,144.69 MCP2.VSS